# EAGLE schematic oresat-proto-card (EAGLE 9.6.2)

## Sheet 1 of 3: Connectors
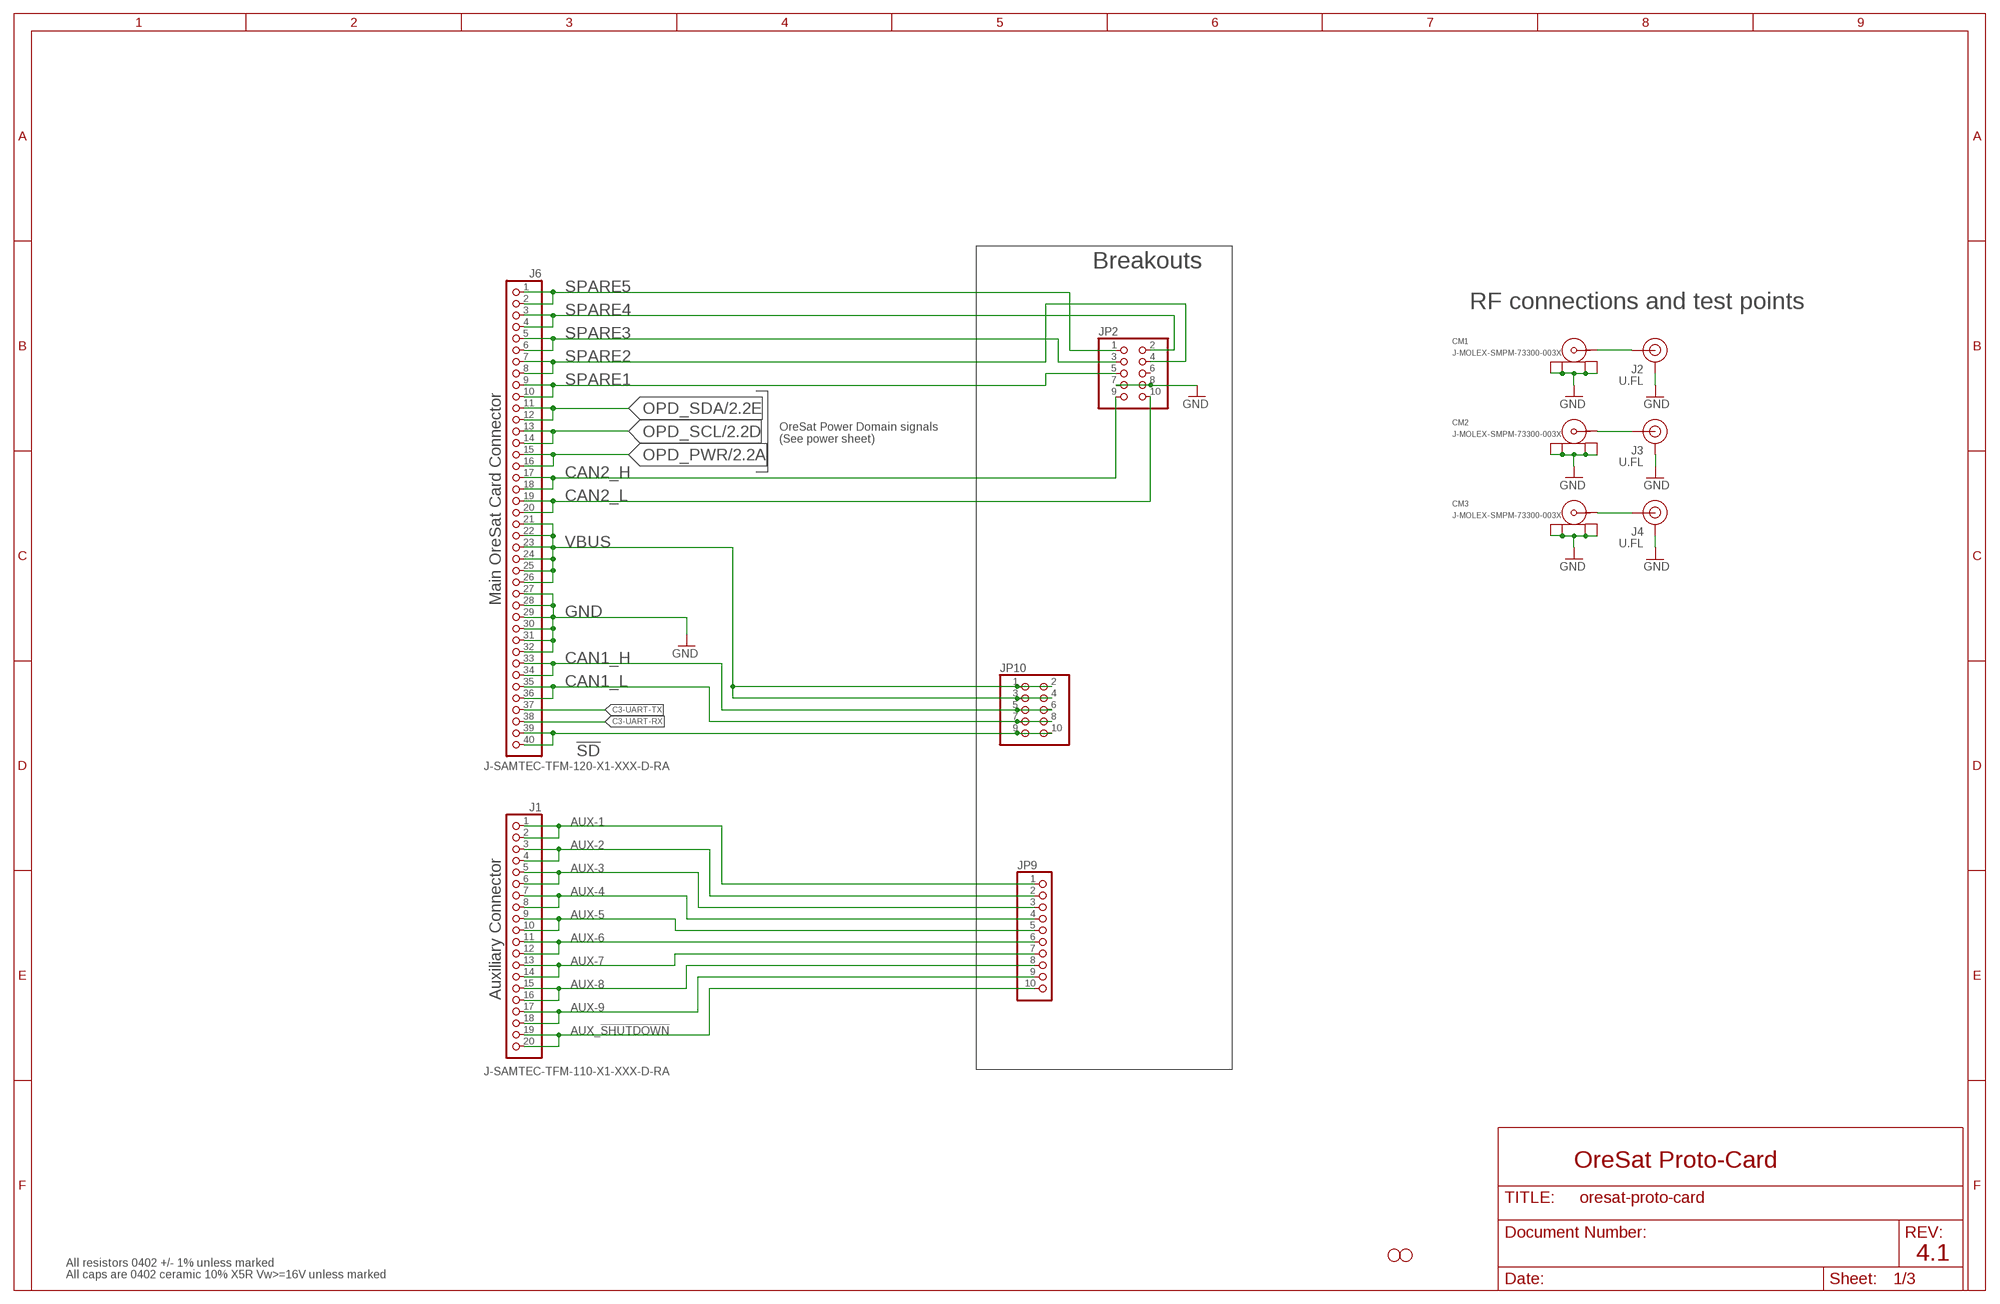
[diagram p0: schematic, sheet 1]

### Parts
CM1  J-MOLEX-SMPM-73300-003X  [J-MOLEX-SMPM-073300-003X]
CM2  J-MOLEX-SMPM-73300-003X  [J-MOLEX-SMPM-073300-003X]
CM3  J-MOLEX-SMPM-73300-003X  [J-MOLEX-SMPM-073300-003X]
H2  STAND-OFFTIGHT  [STAND-OFF-TIGHT]
H3  STAND-OFFTIGHT  [STAND-OFF-TIGHT]
J1  J-SAMTEC-TFM-110-X1-XXX-D-RA  [J-SAMTEC-TFM-110-X1-XXX-D-RA]
J2  U.FL  U.FL2PIN  [U.FL]
J3  U.FL  U.FL2PIN  [U.FL]
J4  U.FL  U.FL2PIN  [U.FL]
J6  J-SAMTEC-TFM-120-X1-XXX-D-RA  [J-SAMTEC-TFM-120-X1-XXX-D-RA]
JP2  PINHD-2X5  [2X05]
JP9  PINHD-1X10  [1X10]
JP10  PINHD-2X5  [2X05]

### Nets
!SD: J6.39 J6.40 JP10.9 JP10.10
AUX-1: J1.1 J1.2 JP9.1
AUX-2: J1.3 J1.4 JP9.2
AUX-3: J1.5 J1.6 JP9.3
AUX-4: J1.7 J1.8 JP9.4
AUX-5: J1.9 J1.10 JP9.5
AUX-6: J1.11 J1.12 JP9.6
AUX-7: J1.13 J1.14 JP9.7
AUX-8: J1.15 J1.16 JP9.8
AUX-9: J1.17 J1.18 JP9.9
AUX_!SHUTDOWN: J1.19 J1.20 JP9.10
C3-UART-RX: J6.38
C3-UART-TX: J6.37
CAN1_H: J6.33 J6.34 JP10.5 JP10.6
CAN1_L: J6.35 J6.36 JP10.7 JP10.8
CAN2_H: J6.17 J6.18 JP2.9 ; also sheet 3
CAN2_L: J6.19 J6.20 JP2.10 ; also sheet 3
GND: CM1.P$1(SHIELD3) CM1.P$2(SHIELD2) CM1.P$3(SHIELD1) CM1.P$4(SHIELD) CM2.P$1(SHIELD3) CM2.P$2(SHIELD2) CM2.P$3(SHIELD1) CM2.P$4(SHIELD) CM3.P$1(SHIELD3) CM3.P$2(SHIELD2) CM3.P$3(SHIELD1) CM3.P$4(SHIELD) J2.1(GND) J2.2(GND) J3.1(GND) J3.2(GND) J4.1(GND) J4.2(GND) J6.27 J6.28 J6.29 J6.30 J6.31 J6.32 JP2.7 JP2.8 ; also sheet 2,3
N$300: CM3.RF(CENTER) J4.FEED(SIGNAL)
OPD_PWR: J6.15 J6.16 ; also sheet 2
OPD_SCL: J6.13 J6.14 ; also sheet 2
OPD_SDA: J6.11 J6.12 ; also sheet 2
RF1: CM1.RF(CENTER) J2.FEED(SIGNAL)
RF2: CM2.RF(CENTER) J3.FEED(SIGNAL)
SPARE1: J6.9 J6.10 JP2.5
SPARE2: J6.7 J6.8 JP2.4
SPARE3: J6.5 J6.6 JP2.3
SPARE4: J6.3 J6.4 JP2.2
SPARE5: J6.1 J6.2 JP2.1
VBUS: J6.21 J6.22 J6.23 J6.24 J6.25 J6.26 JP10.1 JP10.2 JP10.3 JP10.4 ; also sheet 2
Unconnected: JP2.6

### Notes on the sheet
- Breakouts
- RF connections and test points
- OreSat Power Domain signals
  (See power sheet)
- Main OreSat Card Connector
- Auxiliary Connector
- OreSat Proto-Card
- 4.1
- All resistors 0402 +/- 1% unless marked
- All caps are 0402 ceramic 10% X5R Vw>=16V unless marked

## Sheet 2 of 3: Power
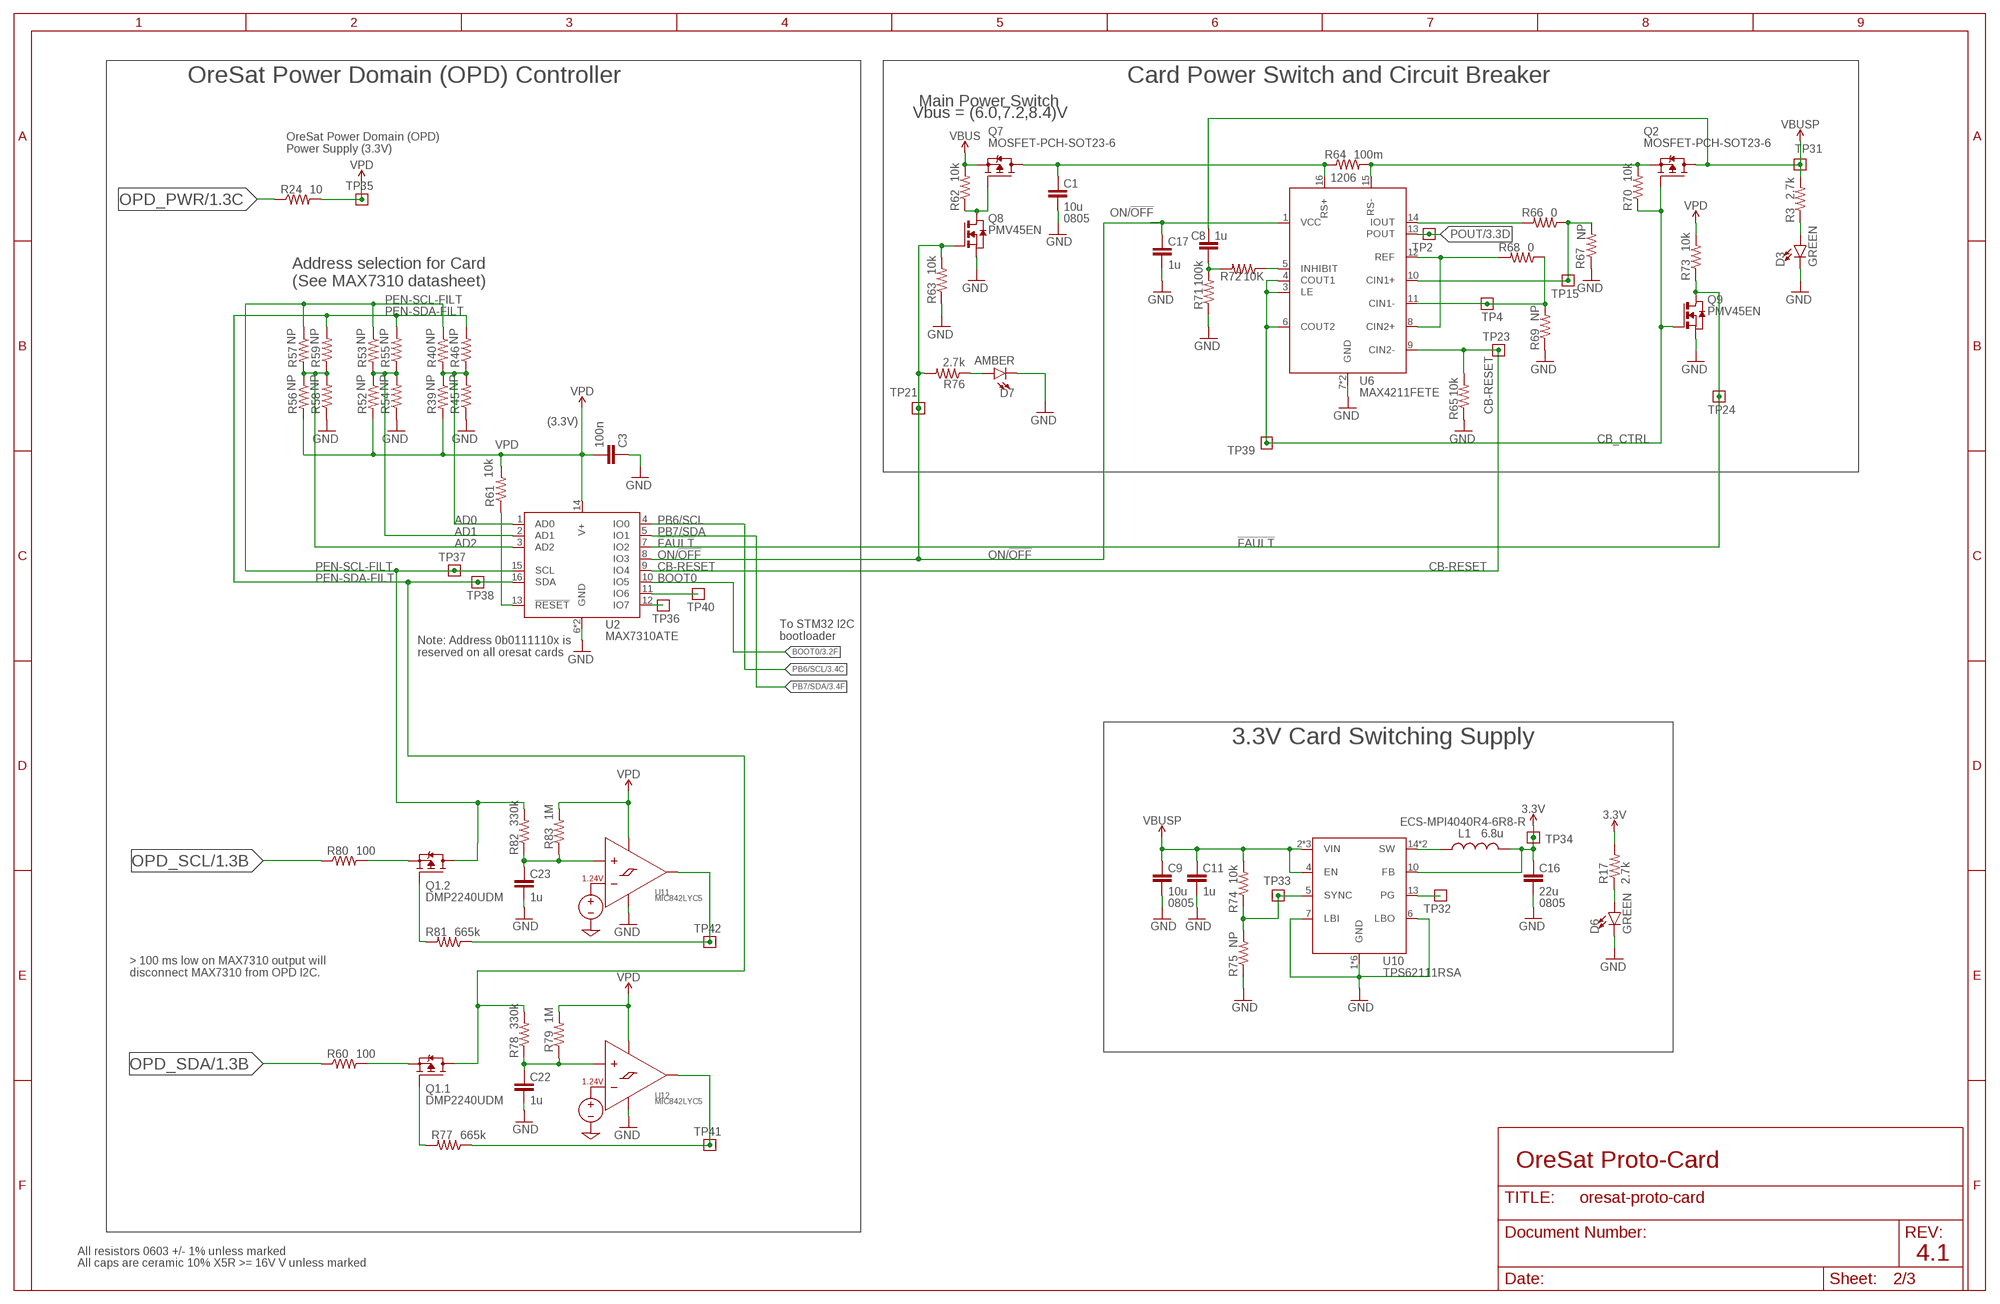
[diagram p1: schematic, sheet 2]

### Parts
C1  10u  C-EU0805-B-NOSILK  [.0805-B-NOSILK]
C3  100n  C-EU0603-C-NOSILK  [.0603-C-NOSILK]
C8  1u  C-EU0603-C-NOSILK  [.0603-C-NOSILK]
C9  10u  C-EU0805-B-NOSILK  [.0805-B-NOSILK]
C11  1u  C-EU0603-C-NOSILK  [.0603-C-NOSILK]
C16  22u  C-EU0805-B-NOSILK  [.0805-B-NOSILK]
C17  1u  C-EU0603-C-NOSILK  [.0603-C-NOSILK]
C22  1u  C-EU0603-C-NOSILK  [.0603-C-NOSILK]
C23  1u  C-EU0603-C-NOSILK  [.0603-C-NOSILK]
D3  GREEN  LED-GREEN0603  [LED-0603]
D6  GREEN  LED-GREEN0603  [LED-0603]
D7  AMBER  LED-GREEN0603  [LED-0603]
L1  6.8u  L-ECS-MPI4040  [ECS-MPI4040]
Q1  DMP2240UDM  MOSFET-PCH-SOT23-6  [SOT23-6]
Q2  MOSFET-PCH-SOT23-6  [SOT23-6]
Q7  MOSFET-PCH-SOT23-6  [SOT23-6]
Q8  PMV45EN  [SOT23]
Q9  PMV45EN  [SOT23]
R3  2.7k  R-US_0603-C-NOSILK  [.0603-C-NOSILK]
R17  2.7k  R-US_0603-C-NOSILK  [.0603-C-NOSILK]
R24  10  R-US_0603-C-NOSILK  [.0603-C-NOSILK]
R39  NP  R-US_0603-C-NOSILK  [.0603-C-NOSILK]
R40  NP  R-US_0603-C-NOSILK  [.0603-C-NOSILK]
R45  NP  R-US_0603-C-NOSILK  [.0603-C-NOSILK]
R46  NP  R-US_0603-C-NOSILK  [.0603-C-NOSILK]
R52  NP  R-US_0603-C-NOSILK  [.0603-C-NOSILK]
R53  NP  R-US_0603-C-NOSILK  [.0603-C-NOSILK]
R54  NP  R-US_0603-C-NOSILK  [.0603-C-NOSILK]
R55  NP  R-US_0603-C-NOSILK  [.0603-C-NOSILK]
R56  NP  R-US_0603-C-NOSILK  [.0603-C-NOSILK]
R57  NP  R-US_0603-C-NOSILK  [.0603-C-NOSILK]
R58  NP  R-US_0603-C-NOSILK  [.0603-C-NOSILK]
R59  NP  R-US_0603-C-NOSILK  [.0603-C-NOSILK]
R60  100  R-US_0603-C-NOSILK  [.0603-C-NOSILK]
R61  10k  R-US_0603-C-NOSILK  [.0603-C-NOSILK]
R62  10k  R-US_0603-C-NOSILK  [.0603-C-NOSILK]
R63  10k  R-US_0603-C-NOSILK  [.0603-C-NOSILK]
R64  100m  R-US_R1206  [R1206]
R65  10k  R-US_0603-C-NOSILK  [.0603-C-NOSILK]
R66  0  R-US_0603-C-NOSILK  [.0603-C-NOSILK]
R67  NP  R-US_0603-C-NOSILK  [.0603-C-NOSILK]
R68  0  R-US_0603-C-NOSILK  [.0603-C-NOSILK]
R69  NP  R-US_0603-C-NOSILK  [.0603-C-NOSILK]
R70  10k  R-US_0603-C-NOSILK  [.0603-C-NOSILK]
R71  100k  R-US_0603-C-NOSILK  [.0603-C-NOSILK]
R72  10K  R-US_0603-C-NOSILK  [.0603-C-NOSILK]
R73  10k  R-US_0603-C-NOSILK  [.0603-C-NOSILK]
R74  10k  R-US_0603-C-NOSILK  [.0603-C-NOSILK]
R75  NP  R-US_0603-C-NOSILK  [.0603-C-NOSILK]
R76  2.7k  R-US_0603-C-NOSILK  [.0603-C-NOSILK]
R77  665k  R-US_0603-C-NOSILK  [.0603-C-NOSILK]
R78  330k  R-US_0603-C-NOSILK  [.0603-C-NOSILK]
R79  1M  R-US_0603-C-NOSILK  [.0603-C-NOSILK]
R80  100  R-US_0603-C-NOSILK  [.0603-C-NOSILK]
R81  665k  R-US_0603-C-NOSILK  [.0603-C-NOSILK]
R82  330k  R-US_0603-C-NOSILK  [.0603-C-NOSILK]
R83  1M  R-US_0603-C-NOSILK  [.0603-C-NOSILK]
TP2  TEST-POINT-LARGE-SQUARE  [1X01]
TP4  TEST-POINT-LARGE-SQUARE  [1X01]
TP15  TEST-POINT-LARGE-SQUARE  [1X01]
TP21  TEST-POINT-LARGE-SQUARE  [1X01]
TP23  TEST-POINT-LARGE-SQUARE  [1X01]
TP24  TEST-POINT-LARGE-SQUARE  [1X01]
TP31  TEST-POINT-LARGE-SQUARE  [1X01]
TP32  TEST-POINT-LARGE-SQUARE  [1X01]
TP33  TEST-POINT-LARGE-SQUARE  [1X01]
TP34  TEST-POINT-LARGE-SQUARE  [1X01]
TP35  TEST-POINT-LARGE-SQUARE  [1X01]
TP36  TEST-POINT-LARGE-SQUARE  [1X01]
TP37  TEST-POINT-LARGE-SQUARE  [1X01]
TP38  TEST-POINT-LARGE-SQUARE  [1X01]
TP39  TEST-POINT-LARGE-SQUARE  [1X01]
TP40  TEST-POINT-LARGE-SQUARE  [1X01]
TP41  TEST-POINT-LARGE-SQUARE  [1X01]
TP42  TEST-POINT-LARGE-SQUARE  [1X01]
U2  MAX7310ATE  MAX7310  [QFN65P400X400X80-17T210]
U6  MAX4211FETE  MAX4211  [QFN65P400X400X80-17T210]
U10  TPS62111RSA  TPS6211X  [S-PVQFN-16]
U11  MIC842LYC5  [SC70-5]
U12  MIC842LYC5  [SC70-5]

### Nets
3.3V: C16.1 L1.2 R17.2 TP34.1 U10.10(FB) ; also sheet 3
!FAULT: Q9.3(D) R73.1 TP24.1 U2.7(IO2)
AD0: R39.1 R40.2 R45.2 R46.1 U2.1(AD0)
AD1: R52.1 R53.2 R54.2 R55.1 U2.2(AD1)
AD2: R56.1 R57.2 R58.2 R59.1 U2.3(AD2)
BOOT0: U2.10(IO5) ; also sheet 3
CB-RESET: R65.2 TP23.1 U2.9(IO4) U6.9(CIN2-)
CB_CTRL: Q2.3(G) Q9.1(G) R70.1 TP39.1 U6.3(LE) U6.4(COUT1) U6.6(COUT2)
GND: C1.2 C3.1 C9.2 C11.2 C16.2 C17.2 C22.2 C23.2 D3.C D6.C D7.C Q8.2(S) Q9.2(S) R45.1 R54.1 R58.1 R63.1 R65.1 R67.1 R69.1 R71.1 R75.1 U2.6(GND) U2.EPAD(GND) U6.7(GND) U6.EPAD(GND) U10.1(GND) U10.6(LBO) U10.7(LBI) U10.9(GND) U10.11(GND) U10.12(GND) U10.16(GND) U10.PAD(GND) U11.2(GND) U12.2(GND) ; also sheet 1,3
IOUT1: R66.2 U6.14(IOUT)
N$398: Q1.1(.1:G) R77.2
N$400: Q1.3(.2:G) R81.2
N$518: D3.A R3.1
N$519: D6.A R17.1
N$520: R61.1 U2.13(!RESET)
N$529: Q7.3(G) Q8.3(D) R62.1
N$530: C1.1 Q7.1(D) Q7.2(D) Q7.5(D) Q7.6(D) R64.1 U6.16(RS+)
N$531: R66.1 R67.2 TP15.1 U6.10(CIN1+)
N$532: R68.1 R69.2 TP4.1 U6.11(CIN1-)
N$533: R68.2 U6.8(CIN2+) U6.12(REF)
N$534: R72.1 U6.5(INHIBIT)
N$535: C8.1 R71.2 R72.2
N$536: Q2.4(S) R64.2 R70.2 U6.15(RS-)
N$537: D7.A R76.1
N$538: Q1.5(.1:S) R60.2
N$539: R77.1 TP41.1 U12.4(OUT)
N$540: TP40.1 U2.11(IO6)
N$541: Q1.2(.2:S) R80.2
N$573: R81.1 TP42.1 U11.4(OUT)
N$574: C23.1 R82.1 R83.1 U11.1(INP)
N$578: C22.1 R78.1 R79.1 U12.1(INP)
N$581: TP36.1 U2.12(IO7)
ON/!OFF: C17.1 Q8.1(G) R63.2 R76.2 TP21.1 U2.8(IO3) U6.1(VCC)
OPD_PWR: R24.1 ; also sheet 1
OPD_SCL: R80.1 ; also sheet 1
OPD_SDA: R60.1 ; also sheet 1
PB6/SCL: U2.4(IO0) ; also sheet 3
PB7/SDA: U2.5(IO1) ; also sheet 3
PEN-SCL-FILT: Q1.4(.2:D) R40.1 R53.1 R57.1 R82.2 TP37.1 U2.15(SCL)
PEN-SDA-FILT: Q1.6(.1:D) R46.2 R55.2 R59.2 R78.2 TP38.1 U2.16(SDA)
POUT: TP2.1 U6.13(POUT) ; also sheet 3
TPS62111-PG1: TP32.1 U10.13(PG)
TPS62111-SYNC1: R74.1 R75.2 TP33.1 U10.5(SYNC)
TPS62111_SW3: L1.1 U10.14(SW) U10.15(SW)
VBUS: Q7.4(S) R62.2 ; also sheet 1
VBUSP: C8.2 C9.1 C11.1 Q2.1(D) Q2.2(D) Q2.5(D) Q2.6(D) R3.2 R74.2 TP31.1 U10.2(VIN) U10.3(VIN) U10.4(EN) U10.8(VIN) ; also sheet 3
VPD: C3.2 R24.2 R39.2 R52.2 R56.2 R61.2 R73.2 R79.2 R83.2 TP35.1 U2.14(V+) U11.5(VDD) U12.5(VDD)

### Notes on the sheet
- OreSat Power Domain (OPD) Controller | Card Power Switch and Circuit Breaker
- Main Power Switch
- Vbus = (6.0,7.2,8.4)V
- OreSat Power Domain (OPD)
  Power Supply (3.3V)
- 1206
- 0805
- Address selection for Card
  (See MAX7310 datasheet)
- (3.3V)
- To STM32 I2C
  bootloader
- Note: Address 0b0111110x is 
  reserved on all oresat cards
- 3.3V Card Switching Supply
- ECS-MPI4040R4-6R8-R
- 0805 | 0805
- > 100 ms low on MAX7310 output will
  disconnect MAX7310 from OPD I2C.
- OreSat Proto-Card
- All resistors 0603 +/- 1% unless marked
- 4.1
- All caps are ceramic 10% X5R >= 16V V unless marked

## Sheet 3 of 3: Microcontroller
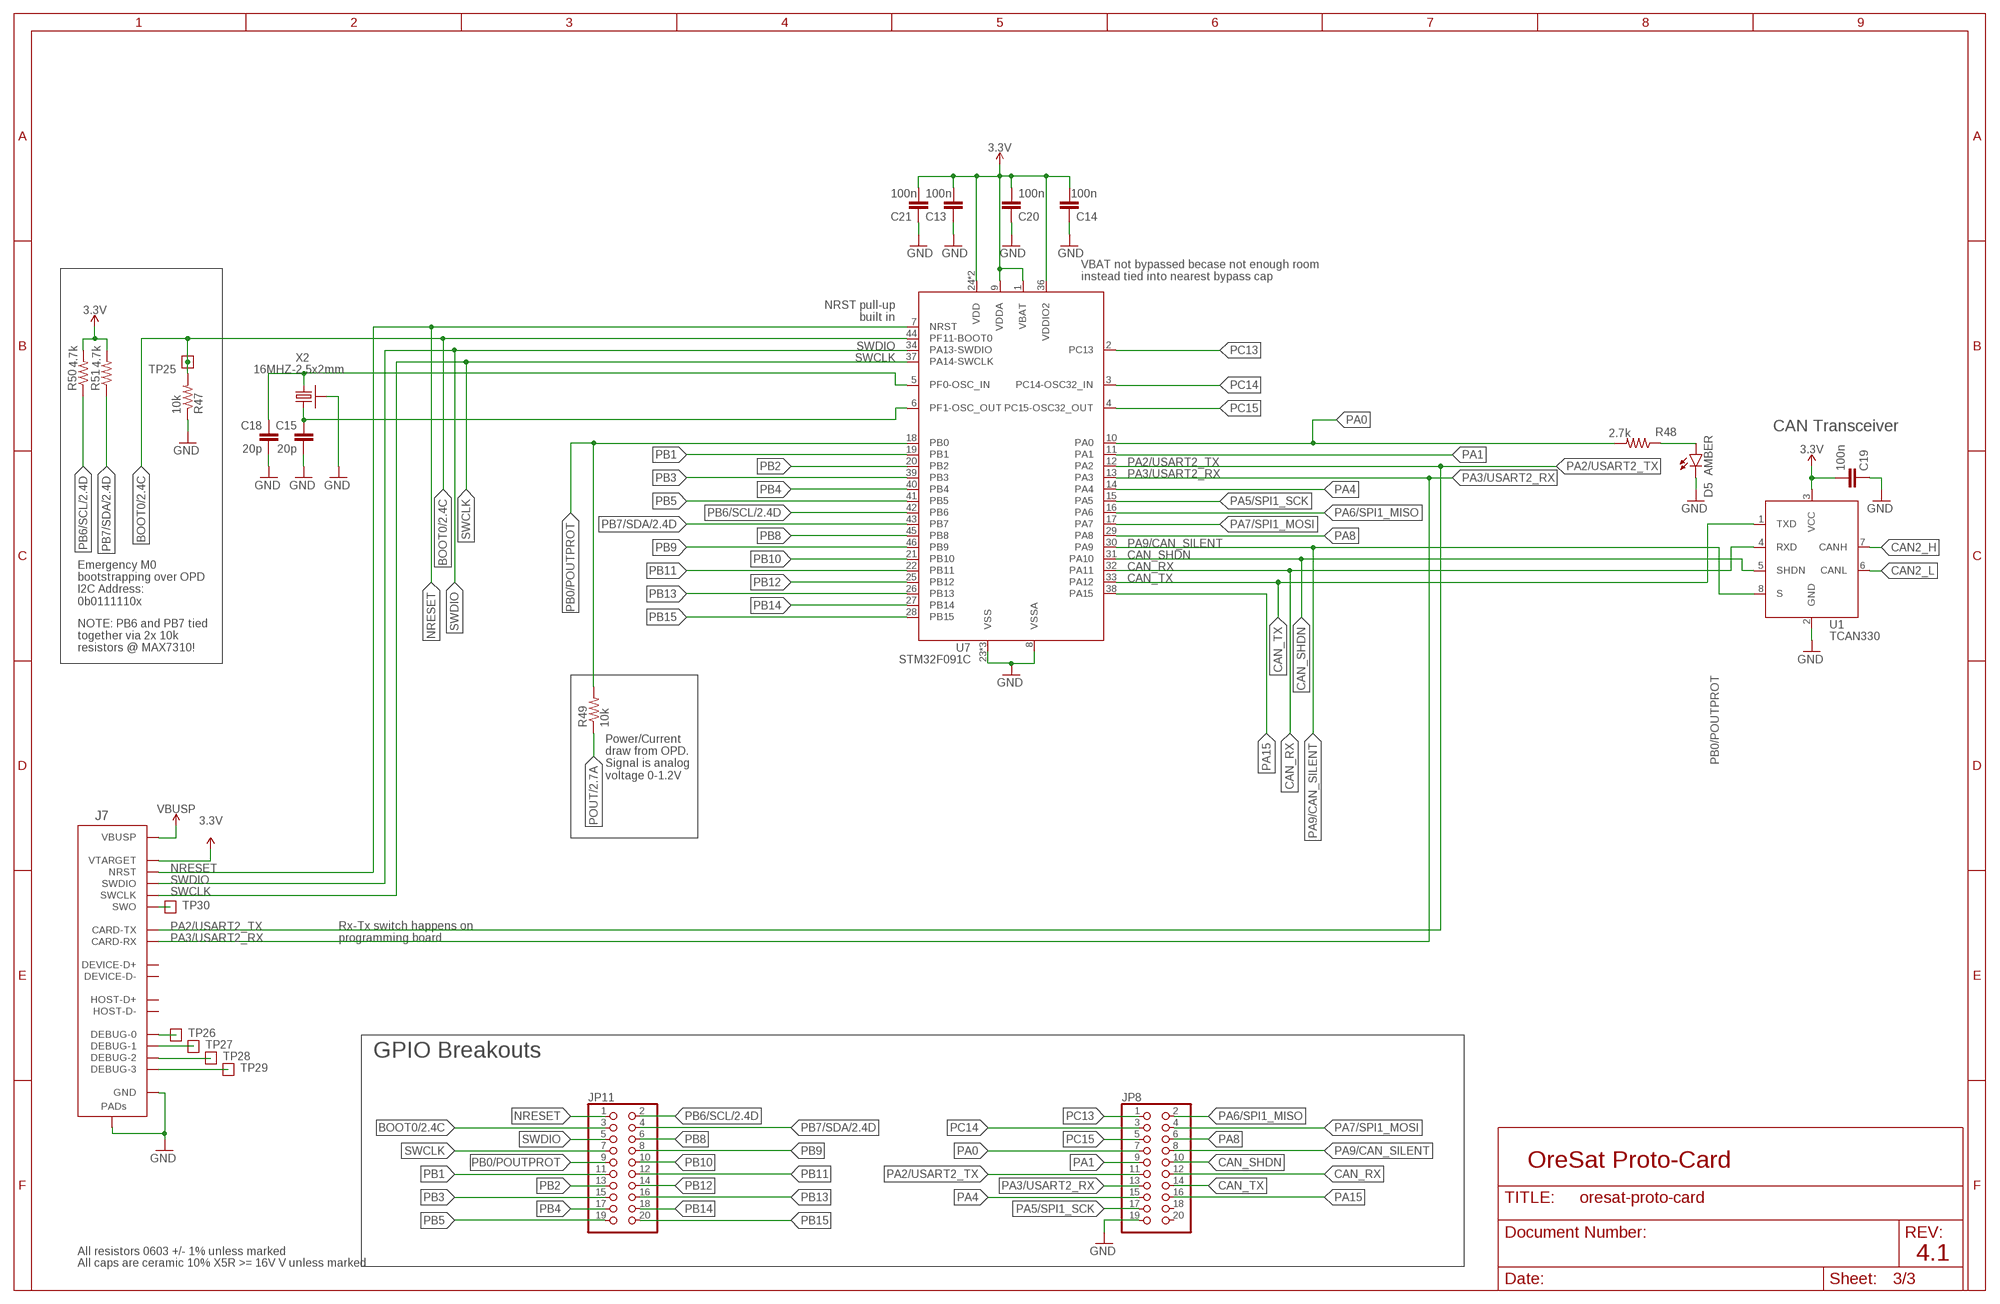
[diagram p2: schematic, sheet 3]

### Parts
C13  100n  C-EU0603-C-NOSILK  [.0603-C-NOSILK]
C14  100n  C-EU0603-C-NOSILK  [.0603-C-NOSILK]
C15  20p  C-EU0603-C-NOSILK  [.0603-C-NOSILK]
C18  20p  C-EU0603-C-NOSILK  [.0603-C-NOSILK]
C19  100n  C-EU0603-C-NOSILK  [.0603-C-NOSILK]
C20  100n  C-EU0603-C-NOSILK  [.0603-C-NOSILK]
C21  100n  C-EU0603-C-NOSILK  [.0603-C-NOSILK]
D5  AMBER  LED-GREEN0603  [LED-0603]
J7  ORESAT-DEBUG-CONNECTOR-ALL  [TE_2-1734592-0]
JP8  PINHD-2X10  [2X10]
JP11  PINHD-2X10  [2X10]
R47  10k  R-US_0603-C-NOSILK  [.0603-C-NOSILK]
R48  2.7k  R-US_0603-C-NOSILK  [.0603-C-NOSILK]
R49  10k  R-US_0603-C-NOSILK  [.0603-C-NOSILK]
R50  4.7k  R-US_0603-C-NOSILK  [.0603-C-NOSILK]
R51  4.7k  R-US_0603-C-NOSILK  [.0603-C-NOSILK]
TP25  TEST-POINT-LARGE-SQUARE  [1X01]
TP26  TEST-POINT-LARGE-SQUARE  [1X01]
TP27  TEST-POINT-LARGE-SQUARE  [1X01]
TP28  TEST-POINT-LARGE-SQUARE  [1X01]
TP29  TEST-POINT-LARGE-SQUARE  [1X01]
TP30  TEST-POINT-LARGE-SQUARE  [1X01]
U1  TCAN330  [SOT23-8_TI-DCN]
U7  STM32F091C  [STM32F091C]
X2  16MHZ-2.5x2mm  CRYSTAL-WITH-GND  [CRYSTAL_2.5X2]

### Nets
3.3V: C13.2 C14.2 C19.2 C20.2 C21.2 J7.11(VTARGET) R50.2 R51.2 U1.3(VCC) U7.1(VBAT) U7.9(VDDA) U7.24(VDD) U7.36(VDDIO2) U7.48(VDD) ; also sheet 2
BOOT0: JP11.3 R47.2 TP25.1 U7.44(PF11-BOOT0) ; also sheet 2
CAN2_H: U1.7(CANH) ; also sheet 1
CAN2_L: U1.6(CANL) ; also sheet 1
CAN_RX: JP8.12 U1.4(RXD) U7.32(PA11)
CAN_SHDN: JP8.10 U1.5(SHDN) U7.31(PA10)
CAN_TX: JP8.14 U1.1(TXD) U7.33(PA12)
CRYSTALIN1: C18.1 U7.5(PF0-OSC_IN) X2.1
CRYSTALOUT1: C15.1 U7.6(PF1-OSC_OUT) X2.3
GND: C13.1 C14.1 C15.2 C18.2 C19.1 C20.1 C21.1 D5.C J7.3(GND) J7.6(GND) J7.9(GND) J7.PAD1(PAD) J7.PAD2(PAD) JP8.19 R47.1 U1.2(GND) U7.8(VSSA) U7.23(VSS) U7.35(VSS) U7.47(VSS) X2.2(SHIELD) X2.4(SHIELD) ; also sheet 1,2
N$521: D5.A R48.1
N$522: J7.20(DEBUG-3) TP29.1
N$523: J7.19(DEBUG-2) TP28.1
N$524: J7.18(DEBUG-1) TP27.1
N$525: J7.17(DEBUG-0) TP26.1
N$526: J7.16(SWO) TP30.1
NRESET: J7.10(NRST) JP11.1 U7.7(NRST)
PA0: JP8.7 R48.2 U7.10(PA0)
PA1: JP8.9 U7.11(PA1)
PA2/USART2_TX: J7.13(CARD-TX) JP8.11 U7.12(PA2)
PA3/USART2_RX: J7.12(CARD-RX) JP8.13 U7.13(PA3)
PA4: JP8.15 U7.14(PA4)
PA5/SPI1_SCK: JP8.17 U7.15(PA5)
PA6/SPI1_MISO: JP8.2 U7.16(PA6)
PA7/SPI1_MOSI: JP8.4 U7.17(PA7)
PA8: JP8.6 U7.29(PA8)
PA9/CAN_SILENT: JP8.8 U1.8(S) U7.30(PA9)
PA15: JP8.16 U7.38(PA15)
PB0/POUTPROT: JP11.9 R49.2 U7.18(PB0)
PB1: JP11.11 U7.19(PB1)
PB2: JP11.13 U7.20(PB2)
PB3: JP11.15 U7.39(PB3)
PB4: JP11.17 U7.40(PB4)
PB5: JP11.19 U7.41(PB5)
PB6/SCL: JP11.2 R50.1 U7.42(PB6) ; also sheet 2
PB7/SDA: JP11.4 R51.1 U7.43(PB7) ; also sheet 2
PB8: JP11.6 U7.45(PB8)
PB9: JP11.8 U7.46(PB9)
PB10: JP11.10 U7.21(PB10)
PB11: JP11.12 U7.22(PB11)
PB12: JP11.14 U7.25(PB12)
PB13: JP11.16 U7.26(PB13)
PB14: JP11.18 U7.27(PB14)
PB15: JP11.20 U7.28(PB15)
PC13: JP8.1 U7.2(PC13)
PC14: JP8.3 U7.3(PC14-OSC32_IN)
PC15: JP8.5 U7.4(PC15-OSC32_OUT)
POUT: R49.1 ; also sheet 2
SWCLK: J7.15(SWCLK) JP11.7 U7.37(PA14-SWCLK)
SWDIO: J7.14(SWDIO) JP11.5 U7.34(PA13-SWDIO)
VBUSP: J7.1(VBUSP) J7.2(VBUSP) ; also sheet 2
Unconnected: J7.4(DEVICE-D+) J7.5(DEVICE-D-) J7.7(HOST-D+) J7.8(HOST-D-) JP8.18 JP8.20

### Notes on the sheet
- VBAT not bypassed becase not enough room
  instead tied into nearest bypass cap
- NRST pull-up
  built in
- CAN Transceiver
- Emergency M0 
  bootstrapping over OPD 
  I2C Address: 
  0b0111110x
- NOTE: PB6 and PB7 tied
  together via 2x 10k
  resistors @ MAX7310!
- Power/Current 
  draw from OPD.
  Signal is analog 
  voltage 0-1.2V
- Rx-Tx switch happens on 
  programming board
- GPIO Breakouts
- OreSat Proto-Card
- All resistors 0603 +/- 1% unless marked
- 4.1
- All caps are ceramic 10% X5R >= 16V V unless marked

## Library data of the parts
C1 C9 = oresat-rcl:C-EU: CAPACITOR, European symbol; DIS: Digi-Key; DPN: 1276-6472-1-ND; MFR: Samsung; MPN: CL21B106KOQNNNG
C3 = oresat-rcl:C-EU: CAPACITOR, European symbol; DIS: Digi-Key; DPN: 399-14941-1-ND; MFR: Kemet; MPN: C0603C104K4PAC7867
C8 = oresat-rcl:C-EU: CAPACITOR, European symbol
C11 C17 C22 C23 = oresat-rcl:C-EU: CAPACITOR, European symbol; DIS: Digi-Key; DPN: 311-1444-1-ND; MFR: Yageo; MPN: CC0603KRX5R7BB105
C13 C14 C19-C21 = oresat-rcl:C-EU: CAPACITOR, European symbol; DIS: Digi-Key; DPN: 1276-1001-1-ND; MFR: Samsung; MPN: CL05B104KO5NNNC
C15 C18 = oresat-rcl:C-EU: CAPACITOR, European symbol; DIS: Digi-Key; DPN: 1276-6601-1-ND; MFR: Samsung; MPN: CL05C200JB51PNC
C16 = oresat-rcl:C-EU: CAPACITOR, European symbol; DIS: Digi-Key; DPN: 490-9959-1-ND; MFR: Murata; MPN: GRM21BD71A226ME44L
CM1-CM3 = J-Molex-SMPM-73300-003X:J-MOLEX-SMPM-73300-003X; DIS: Digi-Key; DPN: WM10772-ND; MFR: Molex; MPN: 73300-0020
D3 D6 = SparkFun-LED:LED-GREEN: Green SMD LED Used in manufacturing of various products at SparkFun Packages: 0603 - SMD 0603 package [Product Link] <http://www.futureelectronics.com/en/technologies/semiconductors/optoelectronics/leds/Pages/9894312-LTST-C190GKT.aspx?CrossPart=HSMG-C190&IM=0> LilyPad 1206 - SMD1206 LilyPad package [Product Link] <http://www.futureelectronics.com/en/Technologies/Product.aspx?ProductID=IN150NGHARVATEKCORPORATION2049943&IM=0> 1206 - SMD1206 package [Product Link] <http://www.futureelectronics.com/en/technologies/semiconductors/optoelectronics/leds/Pages/8315665-LTST-C150KGKT.aspx?IM=0> 1206 Bottom Mount -SMD 1206 Bottom Mount [Product Link] <http://www.digikey.com/product-detail/en/lite-on-inc/LTST-C230KGKT/160-1456-1-ND/386854> SparkFun Products: Pro Mini 328 -5V <https://www.sparkfun.com/products/821> RedBoard <https://www.sparkfun.com/products/12757> MP3 Trigger <https://www.sparkfun.com/products/13720> Makey Makey <https://www.sparkfun.com/products/11076>; DIS: Digi-Key; DPN: 511-1584-1-ND; MFR: Rohm; MPN: SML-E12M8WT86
D5 D7 = SparkFun-LED:LED-GREEN: Green SMD LED Used in manufacturing of various products at SparkFun Packages: 0603 - SMD 0603 package [Product Link] <http://www.futureelectronics.com/en/technologies/semiconductors/optoelectronics/leds/Pages/9894312-LTST-C190GKT.aspx?CrossPart=HSMG-C190&IM=0> LilyPad 1206 - SMD1206 LilyPad package [Product Link] <http://www.futureelectronics.com/en/Technologies/Product.aspx?ProductID=IN150NGHARVATEKCORPORATION2049943&IM=0> 1206 - SMD1206 package [Product Link] <http://www.futureelectronics.com/en/technologies/semiconductors/optoelectronics/leds/Pages/8315665-LTST-C150KGKT.aspx?IM=0> 1206 Bottom Mount -SMD 1206 Bottom Mount [Product Link] <http://www.digikey.com/product-detail/en/lite-on-inc/LTST-C230KGKT/160-1456-1-ND/386854> SparkFun Products: Pro Mini 328 -5V <https://www.sparkfun.com/products/821> RedBoard <https://www.sparkfun.com/products/12757> MP3 Trigger <https://www.sparkfun.com/products/13720> Makey Makey <https://www.sparkfun.com/products/11076>; DIS: Digi-Key; DPN: 1830-1064-1-ND; MFR: Inolux; MPN: IN-S63AT5A; VALUE: GREEN
H2 H3 = SparkFun-Hardware:STAND-OFF: Stand Off Drill holes for mechanically mounting via screws, standoffs, etc. Note: Use the keepout ring to avoid running the screw head into surrounding components. Variant Overviews STAND-OFF - Mechanical footprint for a #4 phillips button head screw. STAND-OFF-TIGHT - Mechanical footprint for a #4 phillips button head screw, Example SparkFun Products Screw - Phillips Head (1/4", 4-40, 10 pack) <https://www.sparkfun.com/products/10453> (PRT-10453) Screw - Phillips Head (1/2", 4-40, 10 pack) <https://www.sparkfun.com/products/10452> (PRT-10452) Screw - Phillips Head (3/4", 4-40, 10 pack) <https://www.sparkfun.com/products/10451> (PRT-10451) Screw - Phillips Head (1", 4-40, 10 pack) <https://www.sparkfun.com/products/10450> (PRT-10450)
J1 = J-Samtec-TFM-110-X1-XXX-D-RA:J-SAMTEC-TFM-110-X1-XXX-D-RA; DIS: Digikey; DPN: SAM10113-ND; MFR: Samtec; MPN: TFM-110-01-L-D-RA
J2-J4 = SparkFun-Connectors:U.FL2PIN: SMD Antenna Connector - U.FL 2mm height, 3.0mm x 3.0mm receptacle size. SparkFun Products: SparkFun WiFi Shield - ESP8266 <https://www.sparkfun.com/products/13287> SparkFun ESP8266 Thing <https://www.sparkfun.com/products/13231> SparkFun MiniGen - Pro Mini Signal Generator Shield <https://www.sparkfun.com/products/11420>; DIS: Digi-Key; DPN: A118077CT-ND; MFR: TE Connectivity; MPN: 1909763-1; PROD_ID: CONN-09193; SF_ID: WRL-09144
J6 = J-Samtec-TFM-120-X1-XXX-D-RA:J-SAMTEC-TFM-120-X1-XXX-D-RA; DIS: Digi-Key; DPN: SAM10145-ND; MFR: Samtec; MPN: TFM-120-01-L-D-RA
J7 = oresat-debug-connector:ORESAT-DEBUG-CONNECTOR
JP2 JP10 = pinhead:PINHD-2X5: PIN HEADER; DIS: Digi-Key; DPN: 609-3243-ND; MFR: Amphenol; MPN: 67997-410HLF
JP8 JP11 = pinhead:PINHD-2X10: PIN HEADER; DIS: Digi-Key; DNP: 609-3221-ND; MFR: Amphenol; MPN: 67996-420HLF
JP9 = pinhead:PINHD-1X10: PIN HEADER; DIS: Digi-Key; DPN: 732-5329-ND; MFR: Wurth; MPN: 61302011121
L1 = L-ECS-MPI4040:L-ECS-MPI4040; DIS: Digi-Key; DPN: XC2337CT-ND; MFR: ECS; MPN: ECS-MPI4040R4-6R8-R
Q1 = Q-MOSFET-PCH-dual-SOT23-6:MOSFET-PCH-SOT23-6: Dual P channel MOSFETs in an SOT23-6; DIS: Digi-Key; DPN: DMP2240UDMDICT-ND; MFR: Diodes Inc; MPN: DMP2240UDM
Q2 Q7 = Q-MOSFET-PCH-SOT23-6:MOSFET-PCH-SOT23-6: P channel MOSFET in an SOT23-6; DIS: Digi-Key; DPN: DMP3050LVT-7DICT-ND; MFR: Diodes Inc; MPN: DMP3050LVT-7
Q8 Q9 = Tova:PMV45EN; DIS: Digi-Key; DPN: 1727-2307-1-ND; MFR: Nexperia; MPN: PMV45EN2R
R3 R17 R76 = oresat-rcl:R-US_: RESISTOR, American symbol; DIS: Digi-Key; DPN: P2.7KDBCT-ND; MFR: Panasonic; MPN: ERA-3AEB272V
R24 = oresat-rcl:R-US_: RESISTOR, American symbol; DIS: Digi-Key; DPN: 311-10.0HRCT-ND; MFR: Yageo; MPN: RC0603FR-0710RL
R39 R40 R45 R46 R52-R59 R67 R69 R71 R72 R75 = oresat-rcl:R-US_: RESISTOR, American symbol; DIS: Digi-Key; DPN: 1276-4275-1-ND; MFR: Samsung; MPN: RC1005F6653CS
R47 R49 = oresat-rcl:R-US_: RESISTOR, American symbol; DIS: Digi-Key; DPN: 311-10.0KLRCT-ND; MFR: Yageo; MPN: RC0402FR-0710KL
R48 R50 R51 = oresat-rcl:R-US_: RESISTOR, American symbol; DIS: Digi-Key; DPN: A129632CT-ND; MFR: TE Connectivity; MPN: CRGCQ0402F2K7
R60 R80 = oresat-rcl:R-US_: RESISTOR, American symbol; DIS: Digi-Key; DPN: 311-100HRCT-ND; MFR: Yageo; MPN: RC0603FR-07100RL
R61-R63 R65 R70 R73 R74 R77 R81 = oresat-rcl:R-US_: RESISTOR, American symbol; DIS: Digi-Key; DPN: RNCP0603FTD10K0CT-ND; MFR: Stackpole; MPN: RNCP0603FTD10K0
R64 = rcl:R-US_: RESISTOR, American symbol; DIS: Digi-Key; DPN: CSR1206FTR100CT-ND; MFR: Stackpole; MPN: CSR1206FTR100; SPICEPREFIX: R
R66 R68 = oresat-rcl:R-US_: RESISTOR, American symbol; DIS: Digi-Key; DPN: 311-0.0GRCT-ND; MFR: Yageo; MPN: RC0603JR-070RL
R78 R82 = oresat-rcl:R-US_: RESISTOR, American symbol; DIS: Digi-Key; DPN: A129718CT-ND; MFR: TE Connectivity; MPN: CRGCQ0603F330K
R79 R83 = oresat-rcl:R-US_: RESISTOR, American symbol; DIS: Digi-Key; DPN: 311-1.00MHRCT-ND; MFR: Yageo; MPN: RC0603FR-071ML
TP2 TP4 TP15 TP21 TP23-TP42 = oresat-misc:TEST-POINT-LARGE-SQUARE
U1 = TCAN330:TCAN330; DIS: Digi-Key; DPN: 296-44211-1-ND; MFR: Texas Instruments; MPN: TCAN330GDCNT
U2 = U-Maxim-MAX7310-I2C-GPIO-expander:MAX7310; DIS: Digi-Key; DPN: MAX7310ATE+-ND; MFR: Maxim; MPN: MAX7310ATE
U6 = U-Maxim-MAX4211-power-monitor:MAX4211; DIS: Digi-Key; DPN: MAX4211FETE+-ND; MFR: Maxim; MPN: MAX4211FETE
U7 = U-ST-STM32F091C-uC:STM32F091C; DIS: Digi-Key; DPN: 497-18516-ND; MFR: STMicroelectronics; MPN: STM32F042K6T7
U10 = U-TI-TPS6211x-SPS-buck:TPS6211X: TPS6211x 17-V, 1.5-A, Synchronous Step-Down Converter; DIS: Digi-Key; DPN: 296-37681-2-ND; MFR: Texas Instruments; MPN: TPS62111RSA
U11 U12 = U-Microchip-MIC842-Comparator:MIC842L
X2 = low-gain-radio:CRYSTAL-WITH-GND; DIS: Digi-Key; DPN: XC2181CT-ND; MFR: ECS Inc.; MPN: ECS-160-10-36Q-ES-TR